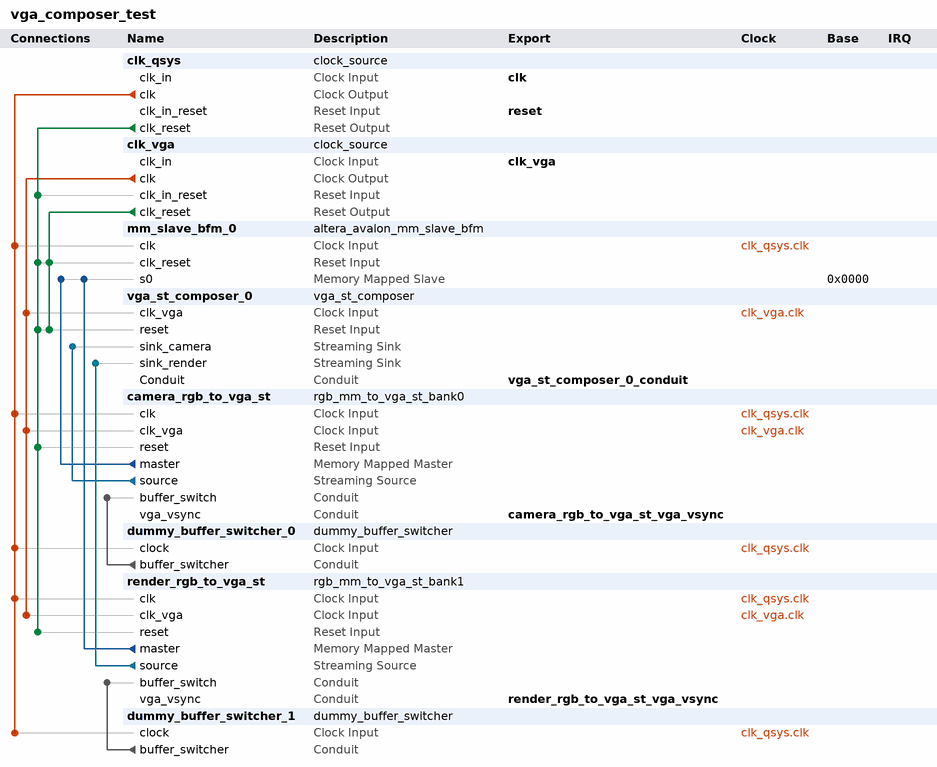
[diagram p0: system contents]
# Platform Designer (Qsys) system vga_composer_test, Cyclone IV GX EP4CGX150DF31C7
# Parameters at their usual value, and those the tool derives, are not listed.
package require -exact qsys 15.0
create_system vga_composer_test
set_project_property DEVICE_FAMILY {Cyclone IV GX}
set_project_property DEVICE EP4CGX150DF31C7

add_instance clk_qsys clock_source 15.0
set_instance_parameter_value clk_qsys clockFrequency 100000000

add_instance clk_vga clock_source 15.0
set_instance_parameter_value clk_vga clockFrequency 25000000

add_instance mm_slave_bfm_0 altera_avalon_mm_slave_bfm 15.0
set_instance_parameter_value mm_slave_bfm_0 ADDRESS_UNITS WORDS
set_instance_parameter_value mm_slave_bfm_0 ASSERT_HIGH_ARBITERLOCK 1
set_instance_parameter_value mm_slave_bfm_0 ASSERT_HIGH_BYTEENABLE 1
set_instance_parameter_value mm_slave_bfm_0 ASSERT_HIGH_LOCK 1
set_instance_parameter_value mm_slave_bfm_0 ASSERT_HIGH_READ 1
set_instance_parameter_value mm_slave_bfm_0 ASSERT_HIGH_READDATAVALID 1
set_instance_parameter_value mm_slave_bfm_0 ASSERT_HIGH_RESET 1
set_instance_parameter_value mm_slave_bfm_0 ASSERT_HIGH_WAITREQUEST 1
set_instance_parameter_value mm_slave_bfm_0 ASSERT_HIGH_WRITE 1
set_instance_parameter_value mm_slave_bfm_0 AV_ADDRESS_W 25
set_instance_parameter_value mm_slave_bfm_0 AV_BURSTCOUNT_W 3
set_instance_parameter_value mm_slave_bfm_0 AV_BURST_BNDR_ONLY 1
set_instance_parameter_value mm_slave_bfm_0 AV_BURST_LINEWRAP 1
set_instance_parameter_value mm_slave_bfm_0 AV_FIX_READ_LATENCY 0
set_instance_parameter_value mm_slave_bfm_0 AV_MAX_PENDING_READS 1
set_instance_parameter_value mm_slave_bfm_0 AV_MAX_PENDING_WRITES 0
set_instance_parameter_value mm_slave_bfm_0 AV_NUMSYMBOLS 4
set_instance_parameter_value mm_slave_bfm_0 AV_READRESPONSE_W 8
set_instance_parameter_value mm_slave_bfm_0 AV_READ_WAIT_TIME 1
set_instance_parameter_value mm_slave_bfm_0 AV_REGISTERINCOMINGSIGNALS 0
set_instance_parameter_value mm_slave_bfm_0 AV_SYMBOL_W 8
set_instance_parameter_value mm_slave_bfm_0 AV_WRITERESPONSE_W 8
set_instance_parameter_value mm_slave_bfm_0 AV_WRITE_WAIT_TIME 0
set_instance_parameter_value mm_slave_bfm_0 REGISTER_WAITREQUEST 0
set_instance_parameter_value mm_slave_bfm_0 USE_ADDRESS 1
set_instance_parameter_value mm_slave_bfm_0 USE_ARBITERLOCK 0
set_instance_parameter_value mm_slave_bfm_0 USE_BEGIN_BURST_TRANSFER 0
set_instance_parameter_value mm_slave_bfm_0 USE_BEGIN_TRANSFER 0
set_instance_parameter_value mm_slave_bfm_0 USE_BURSTCOUNT 0
set_instance_parameter_value mm_slave_bfm_0 USE_BYTE_ENABLE 0
set_instance_parameter_value mm_slave_bfm_0 USE_CLKEN 0
set_instance_parameter_value mm_slave_bfm_0 USE_DEBUGACCESS 0
set_instance_parameter_value mm_slave_bfm_0 USE_LOCK 1
set_instance_parameter_value mm_slave_bfm_0 USE_READ 1
set_instance_parameter_value mm_slave_bfm_0 USE_READRESPONSE 0
set_instance_parameter_value mm_slave_bfm_0 USE_READ_DATA 1
set_instance_parameter_value mm_slave_bfm_0 USE_READ_DATA_VALID 1
set_instance_parameter_value mm_slave_bfm_0 USE_TRANSACTIONID 0
set_instance_parameter_value mm_slave_bfm_0 USE_WAIT_REQUEST 1
set_instance_parameter_value mm_slave_bfm_0 USE_WRITE 0
set_instance_parameter_value mm_slave_bfm_0 USE_WRITERESPONSE 0
set_instance_parameter_value mm_slave_bfm_0 USE_WRITE_DATA 0
set_instance_parameter_value mm_slave_bfm_0 VHDL_ID 0

add_instance vga_st_composer_0 vga_st_composer 1.0
set_instance_parameter_value vga_st_composer_0 DATA_WIDTH 32
set_instance_parameter_value vga_st_composer_0 FIFO_LENGTH_LOG_2 6

add_instance camera_rgb_to_vga_st rgb_mm_to_vga_st_bank0 1.0

add_instance dummy_buffer_switcher_0 dummy_buffer_switcher 1.0
set_instance_parameter_value dummy_buffer_switcher_0 FIXED_BUFFER_PORT 0

add_instance render_rgb_to_vga_st rgb_mm_to_vga_st_bank1 1.0

add_instance dummy_buffer_switcher_1 dummy_buffer_switcher 1.0
set_instance_parameter_value dummy_buffer_switcher_1 FIXED_BUFFER_PORT 0

# connections
add_connection clk_qsys.clk camera_rgb_to_vga_st.clk clock
add_connection clk_qsys.clk dummy_buffer_switcher_0.clock clock
add_connection clk_qsys.clk dummy_buffer_switcher_1.clock clock
add_connection clk_qsys.clk mm_slave_bfm_0.clk clock
add_connection clk_qsys.clk render_rgb_to_vga_st.clk clock
add_connection clk_vga.clk camera_rgb_to_vga_st.clk_vga clock
add_connection clk_vga.clk render_rgb_to_vga_st.clk_vga clock
add_connection clk_vga.clk vga_st_composer_0.clk_vga clock
add_connection clk_qsys.clk_reset camera_rgb_to_vga_st.reset reset
add_connection clk_qsys.clk_reset clk_vga.clk_in_reset reset
add_connection clk_qsys.clk_reset mm_slave_bfm_0.clk_reset reset
add_connection clk_qsys.clk_reset render_rgb_to_vga_st.reset reset
add_connection clk_qsys.clk_reset vga_st_composer_0.reset reset
add_connection clk_vga.clk_reset mm_slave_bfm_0.clk_reset reset
add_connection clk_vga.clk_reset vga_st_composer_0.reset reset
add_connection camera_rgb_to_vga_st.master mm_slave_bfm_0.s0 avalon
set_connection_parameter_value camera_rgb_to_vga_st.master/mm_slave_bfm_0.s0 baseAddress 0x0000
add_connection render_rgb_to_vga_st.master mm_slave_bfm_0.s0 avalon
set_connection_parameter_value render_rgb_to_vga_st.master/mm_slave_bfm_0.s0 baseAddress 0x0000
add_connection camera_rgb_to_vga_st.source vga_st_composer_0.sink_camera avalon_streaming
add_connection render_rgb_to_vga_st.source vga_st_composer_0.sink_render avalon_streaming
add_connection dummy_buffer_switcher_0.buffer_switcher camera_rgb_to_vga_st.buffer_switch conduit
add_connection dummy_buffer_switcher_1.buffer_switcher render_rgb_to_vga_st.buffer_switch conduit

# exported interfaces
add_interface camera_rgb_to_vga_st_vga_vsync conduit end
set_interface_property camera_rgb_to_vga_st_vga_vsync EXPORT_OF camera_rgb_to_vga_st.vga_vsync
add_interface clk clock sink
set_interface_property clk EXPORT_OF clk_qsys.clk_in
add_interface clk_vga clock sink
set_interface_property clk_vga EXPORT_OF clk_vga.clk_in
add_interface render_rgb_to_vga_st_vga_vsync conduit end
set_interface_property render_rgb_to_vga_st_vga_vsync EXPORT_OF render_rgb_to_vga_st.vga_vsync
add_interface reset reset sink
set_interface_property reset EXPORT_OF clk_qsys.clk_in_reset
add_interface vga_st_composer_0_conduit conduit end
set_interface_property vga_st_composer_0_conduit EXPORT_OF vga_st_composer_0.Conduit

set_interconnect_requirement {$system} qsys_mm.clockCrossingAdapter HANDSHAKE
set_interconnect_requirement {$system} qsys_mm.enableEccProtection FALSE
set_interconnect_requirement {$system} qsys_mm.insertDefaultSlave FALSE
set_interconnect_requirement {$system} qsys_mm.maxAdditionalLatency 1

save_system vga_composer_test.qsys
